# Altium schematic sheet Block-Diagram.SchDoc
size A4; SheetNumber: 5; SheetTotal: 5
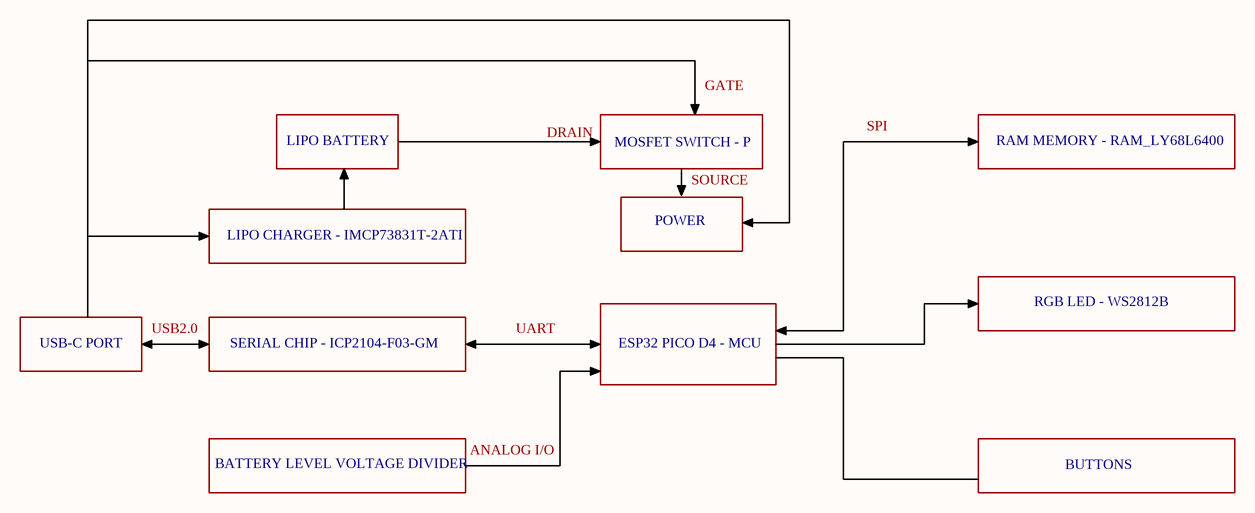
[diagram p0: Block-Diagram.SchDoc]

## Notes on the sheet
- GATE
- LIPO BATTERY
- DRAIN
- MOSFET SWITCH - P
- SPI
- RAM MEMORY - RAM_LY68L6400
- POWER
- SOURCE
- LIPO CHARGER - IMCP73831T-2ATI
- RGB LED - WS2812B
- USB-C PORT
- USB2.0
- SERIAL CHIP - ICP2104-F03-GM
- UART
- ESP32 PICO D4 - MCU
- BATTERY LEVEL VOLTAGE DIVIDER
- ANALOG I/O
- BUTTONS